# Altium schematic sheet coaster.SchDoc
size A3; SheetNumber: 1; SheetTotal: 1
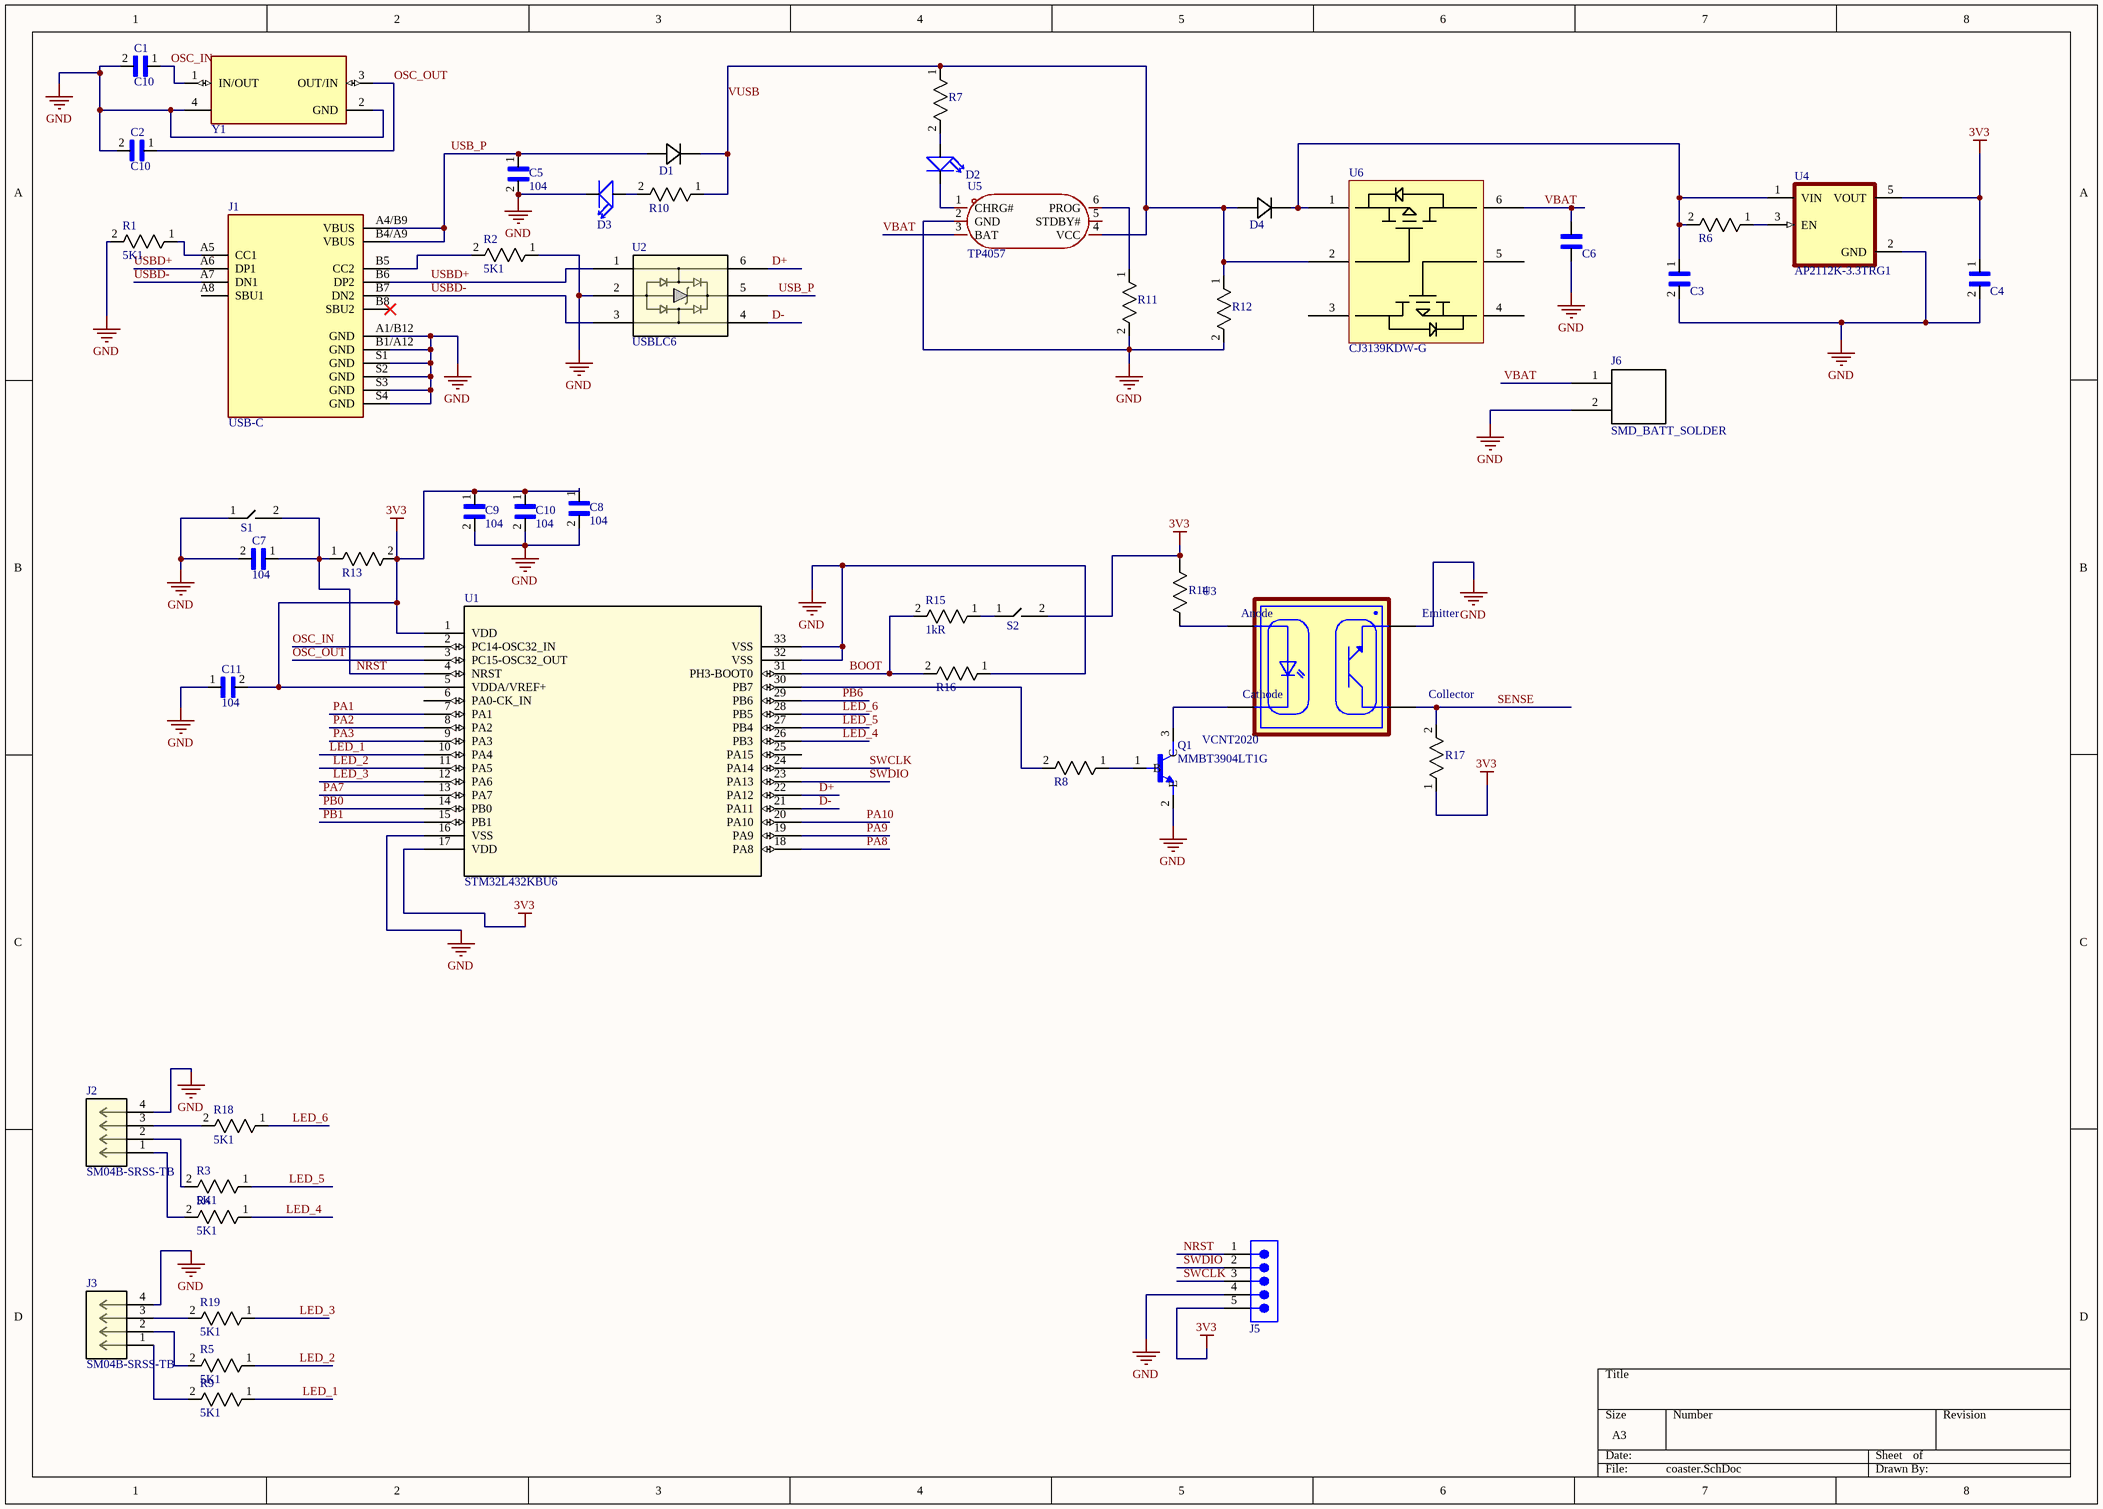
[diagram p0: coaster.SchDoc]

## Parts
C1  C10  [RC0402]
C2  C10  [RC0402]
C3  CC0402KRX5R5BB105  [RC0402]  (value not drawn)
C4  CC0402KRX5R5BB105  [RC0402]  (value not drawn)
C5  104  [CAPC1005X55N2]
C6  CL21A106KOQNNNG  [CAPC2012X140N]  (value not drawn)
C7  104  [CAPC1005X55N2]
C8  104  [CAPC1005X55N2]
C9  104  [CAPC1005X55N2]
C10  104  [CAPC1005X55N2]
C11  104  [CAPC1005X55N2]
D1  SD103AWS-E3-08  [CR_WS-E3-08_VIS-L]  (value not drawn)
D2  LED  [LEDM1608X80]  (value not drawn)
D3  LED  [LEDM1608X80]  (value not drawn)
D4  SD103AWS-E3-08  [CR_WS-E3-08_VIS-L]  (value not drawn)
J1  USB-C  [GCT_USB4110GFA]
J2  SM04B-SRSS-TB  [CONN_SM04B-SRSS-TB_JST]
J3  SM04B-SRSS-TB  [CONN_SM04B-SRSS-TB_JST]
J5  61300511121  [HEADER_M_5]  (value not drawn)
J6  SMD_BATT_SOLDER  [SMD_BATT_SOLDER]
Q1  MMBT3904LT1G  [SOT95P240X111-3N]
R1  5K1  [RC0402]
R2  5K1  [RC0402]
R3  5K1  [RC0402]
R4  5K1  [RC0402]
R5  5K1  [RC0402]
R6  15K0402  [RC0402X]  (value not drawn)
R7  ERA-2AEB332X  [RC0402]  (value not drawn)
R8  15K0402  [RC0402X]  (value not drawn)
R9  5K1  [RC0402]
R10  ERA-2AEB332X  [RC0402]  (value not drawn)
R11  RC0402JR-0710KL  [RC0402X]  (value not drawn)
R12  RC0402JR-07100KL  [RC0402X]  (value not drawn)
R13  RC0402JR-0710KL  [RC0402X]  (value not drawn)
R14  CRGCQ1206F2K2  [STA_RMCF1206_STP-L]  (value not drawn)
R15  Resistance: 1kR  [RC0402X]  (hidden comment: RC0402JR-071KL)
R16  RC0402JR-07100KL  [RC0402X]  (value not drawn)
R17  RC0402JR-0710KL  [RC0402X]  (value not drawn)
R18  5K1  [RC0402]
R19  5K1  [RC0402]
S1  SW_P  [SW]  (value not drawn)
S2  SW_P  [SW]  (value not drawn)
U1  STM32L432KBU6  [UFQFPN-32]
U2  USBLC6  [SOT23-6L_STM]
U3  VCNT2020  [XDCR_VCNT2020]
U4  AP2112K-3.3TRG1  [SOT95P285X140-5N]
U5  TP4057  [SOP65P210X110-6N]
U6  CJ3139KDW-G  [SOP65P210X110-6N]
Y1  ECS-80-12-33-JGN-TR  [XTAL_ECS-240-8-33-AGN-TR]  (value not drawn)

## Nets
3V3: C4.1 C8.1 C9.1 C10.1 C11.2 J5.5 R13.2 R14.2 R17.1 S2.2 U1.1(VDD) U1.5(VDDA/VREF+) U1.17(VDD) U4.5(VOUT)
GND: C1.2 C2.2 C3.2 C4.2 C5.2 C6.1 C7.2 C8.2 C9.2 C10.2 C11.1 D3.C J1.A1/B12(GND) J1.B1/A12(GND) J1.S1(GND) J1.S2(GND) J1.S3(GND) J1.S4(GND) J2.4 J3.4 J5.4 J6.2 Q1.2(E) R1.2 R2.1 R11.2 R12.2 R16.1 S1.1 U1.16(VSS) U1.32(VSS) U1.33(VSS) U2.2 U3.1(EMITTER) U4.2(GND) U5.2(GND) Y1.2(GND) Y1.4(GND)
BOOT: R15.2 R16.2 U1.31(PH3-BOOT0)
D+: U1.22(PA12) U2.6
D-: U1.21(PA11) U2.4
LED_1: R9.1 U1.10(PA4)
LED_2: R5.1 U1.11(PA5)
LED_3: R19.1 U1.12(PA6)
LED_4: R4.1 U1.26(PB3)
LED_5: R3.1 U1.27(PB4)
LED_6: R18.1 U1.28(PB5)
NRST: C7.1 J5.1 R13.1 S1.2 U1.4(NRST)
OSC_IN: C1.1 U1.2(PC14-OSC32_IN) Y1.1(IN/OUT)
OSC_OUT: C2.1 U1.3(PC15-OSC32_OUT) Y1.3(OUT/IN)
PA1: U1.7(PA1)
PA2: U1.8(PA2)
PA3: U1.9(PA3)
PA7: U1.13(PA7)
PA8: U1.18(PA8)
PA9: U1.19(PA9)
PA10: U1.20(PA10)
PB0: U1.14(PB0)
PB1: U1.15(PB1)
PB6: U1.29(PB6)
SENSE: R17.2 U3.2(COLLECTOR)
SWCLK: J5.3 U1.24(PA14)
SWDIO: J5.2 U1.23(PA13)
USB_P: C5.1 D1.2 J1.A4/B9(VBUS) J1.B4/A9(VBUS) U2.5
USBD+: J1.A6(DP1) J1.B6(DP2) U2.1
USBD-: J1.A7(DN1) J1.B7(DN2) U2.3
VBAT: C6.2 J6.1 U5.3(BAT) U6.6
VUSB: D1.1 D4.2 R7.1 R10.1 R12.1 U5.4(VCC) U6.2
NetC3_1: C3.1 D4.1 R6.2 U4.1(VIN) U6.1
NetD2_A: D2.A R7.2
NetD2_C: D2.C U5.1(CHRG#)
NetD3_A: D3.A R10.2
NetJ1_A5: J1.A5(CC1) R1.1
NetJ1_B5: J1.B5(CC2) R2.2
NetJ2_1: J2.1 R4.2
NetJ2_2: J2.2 R3.2
NetJ2_3: J2.3 R18.2
NetJ3_1: J3.1 R9.2
NetJ3_2: J3.2 R5.2
NetJ3_3: J3.3 R19.2
NetQ1_1: Q1.1(B) R8.1
NetQ1_3: Q1.3(C) U3.4(CATHODE)
NetR6_1: R6.1 U4.3(EN)
NetR8_2: R8.2 U1.30(PB7)
NetR11_1: R11.1 U5.6(PROG)
NetR14_1: R14.1 U3.3(ANODE)
NetR15_1: R15.1 S2.1

Not connected (* = marked no-connect by the designer): J1 A8(SBU1) B8(SBU2)*; U1 6(PA0-CK_IN) 25(PA15); U5 5(STDBY#); U6 3 4 5

## Notes on the sheet
- (in symbol VCNT2020) Anode; Emitter; Cathode; Collector

## Library data of the parts
C1 C2 = C10: 0402 10 pF 50 V ±5 % Tolerance NP0 SMT Multilayer Ceramic Capacitor; Manufacturer: Yageo; Manufacturer Part Number: CC0402JRNPO9BN100; Dielectric Material: 4241ConductorMaterial; Capacitance: 10pF; Tolerance: 5%; Voltage Rating: 50V; Dielectric: C0G; Temperature Coefficient: 30ppm/°C; Insulation Resistance: 100GR; Supplier 1: Digikey; RoHS: Yes; Category: Ceramic Capacitors; Stock 1: 1109319; Pricing 1: 1=0.1, 10=0.024, 100=0.0133, 1000=0.00812, 2500=0.00685, 5000=0.00609 (USD); Mount: Surface Mount; Case/Package: 0402; Number of Pins: 2; Case Code (Metric): 1005; Case Code (Imperial): 0402; Min Operating Temperature: -55°C; Max Operating Temperature: 125°C; Packaging: Tape and Reel; Voltage Rating (DC): 50V; Package Quantity: 1; Termination: SMD/SMT; Voltage: 50V; Series: CC; Voltage Rating (AC): 50V; Length: 1mm; Width: 0.02inch; Height: 0.5mm; Thickness: 0.022inch; Depth: 0.5mm; Radiation Hardening: No; Reach SVHC Compliant: No; Lead Free: Lead Free; RoHS Compliant: Yes; Halogen Free: 5694HalogenFree; ComponentLink1URL: https://datasheet.ciiva.com/11786/0900766b8079c870-11786158.pdf?src-supplier=Rs; ComponentLink1Description: https://datasheet.ciiva.com/11786/0900766b8079c870-11786158.pdf?src-supplier=Rs; ComponentLink2URL: https://datasheet.ciiva.com/143/mlccorderingcode-143992.pdf?src-supplier=Digikey; ComponentLink2Description: https://datasheet.ciiva.com/143/mlccorderingcode-143992.pdf?src-supplier=Digikey; ComponentLink3URL: https://datasheet.ciiva.com/143/mlccorderingcode-143993.pdf?src-supplier=Digikey; ComponentLink3Description: https://datasheet.ciiva.com/143/mlccorderingcode-143993.pdf?src-supplier=Digikey; ComponentLink4URL: https://datasheet.ciiva.com/143/mlccorderingcode-143994.pdf?src-supplier=Digikey; ComponentLink4Description: https://datasheet.ciiva.com/143/mlccorderingcode-143994.pdf?src-supplier=Digikey; ComponentLink5URL: https://datasheet.ciiva.com/8033/1443161-8033591.pdf?src-supplier=Element14; ComponentLink5Description: https://datasheet.ciiva.com/8033/1443161-8033591.pdf?src-supplier=Element14; ComponentLink6URL: https://datasheet.ciiva.com/8033/1443161-8033593.pdf?src-supplier=Element14; ComponentLink6Description: https://datasheet.ciiva.com/8033/1443161-8033593.pdf?src-supplier=Element14; ComponentLink7URL: https://datasheet.ciiva.com/8033/1443161-8033596.pdf?src-supplier=Element14; ComponentLink7Description: https://datasheet.ciiva.com/8033/1443161-8033596.pdf?src-supplier=Element14; ComponentLink8URL: https://datasheet.ciiva.com/28450/1443161-28450213.pdf?src-supplier=Element14; ComponentLink8Description: https://datasheet.ciiva.com/28450/1443161-28450213.pdf?src-supplier=Element14; ComponentLink9URL: https://datasheet.ciiva.com/5427/upy-gp-np0-16v-to-50v-8-5427741.pdf?src-supplier=Mouser; ComponentLink9Description: https://datasheet.ciiva.com/5427/upy-gp-np0-16v-to-50v-8-5427741.pdf?src-supplier=Mouser; Supplier Part Number 1: 311-1014-1-ND
C3 C4 = C105: Multilayer Ceramic Capacitor, 1 uF, 100 V, ï¿½ 10%, X7R, 0402 [1005 Metric]; Manufacturer: Yageo; Capacitance: 1uF; Voltage Rating: 6.3V; Dielectric: X5R; Temperature Coefficient: 30ppm/°C; Supplier 1: Digikey; Manufacturer Part Number: CC0402KRX5R5BB105; RoHS: Yes; Category: Ceramic Capacitors; Stock 1: 21136934; Pricing 1: 1=0.1, 10=0.054, 100=0.0318, 1000=0.02066, 2500=0.01646, 5000=0.01625 (USD); Mount: Surface Mount; Case/Package: 0402; Number of Pins: 2; Case Code (Metric): 1005; Case Code (Imperial): 0402; Dielectric Material: Ceramic; Material: Ceramic; Min Operating Temperature: -55°C; Max Operating Temperature: 85°C; Tolerance: 10%; Voltage Rating (DC): 6.3V; Packaging: Tape and Reel; Termination: SMD/SMT; Series: CC; Voltage Rating (AC): 6.3V; Length: 1mm; Width: 0.5mm; Height: 0.5mm; Depth: 0.5mm; Radiation Hardening: No; Reach SVHC Compliant: No; Lead Free: Lead Free; RoHS Compliant: Yes; Halogen Free: 5694HalogenFree; ComponentLink1URL: https://datasheet.ciiva.com/5789/70765-5789520.pdf?src-supplier=Farnell; ComponentLink1Description: https://datasheet.ciiva.com/5789/70765-5789520.pdf?src-supplier=Farnell; ComponentLink2URL: https://datasheet.ciiva.com/176/mlccorderingcode-176609.pdf?src-supplier=Digikey; ComponentLink2Description: https://datasheet.ciiva.com/176/mlccorderingcode-176609.pdf?src-supplier=Digikey; ComponentLink3URL: https://datasheet.ciiva.com/176/mlccorderingcode-176610.pdf?src-supplier=Digikey; ComponentLink3Description: https://datasheet.ciiva.com/176/mlccorderingcode-176610.pdf?src-supplier=Digikey; ComponentLink4URL: https://datasheet.ciiva.com/176/mlccorderingcode-176611.pdf?src-supplier=Digikey; ComponentLink4Description: https://datasheet.ciiva.com/176/mlccorderingcode-176611.pdf?src-supplier=Digikey; ComponentLink5URL: https://datasheet.ciiva.com/11464/upy-gphc-x5r-4v-to-50v-12-11464863.pdf?src-supplier=Avnet; ComponentLink5Description: https://datasheet.ciiva.com/11464/upy-gphc-x5r-4v-to-50v-12-11464863.pdf?src-supplier=Avnet; ComponentLink6URL: https://datasheet.ciiva.com/8033/1525783-8033643.pdf?src-supplier=Element14; ComponentLink6Description: https://datasheet.ciiva.com/8033/1525783-8033643.pdf?src-supplier=Element14; ComponentLink7URL: https://datasheet.ciiva.com/8033/1525783-8033644.pdf?src-supplier=Element14; ComponentLink7Description: https://datasheet.ciiva.com/8033/1525783-8033644.pdf?src-supplier=Element14; ComponentLink8URL: https://datasheet.ciiva.com/8033/70765-8033646.pdf?src-supplier=Element14; ComponentLink8Description: https://datasheet.ciiva.com/8033/70765-8033646.pdf?src-supplier=Element14; ComponentLink9URL: https://datasheet.ciiva.com/28450/1359354-28450285.pdf?src-supplier=Element14; ComponentLink9Description: https://datasheet.ciiva.com/28450/1359354-28450285.pdf?src-supplier=Element14; Supplier Part Number 1: 311-1438-1-ND
C5 C7-C11 = CC0402KRX7R7BB104: Multilayer Ceramic Capacitor, 0.1 uF, 16 V, ï¿½ 10%, X7R, 0402 [1005 Metric]; Manufacturer: Yageo; Material: 4241ConductorMaterial; Capacitance: 100nF; Voltage Rating: 16V; Temperature Coefficient: 30ppm/°C; Supplier 1: Digikey; Manufacturer Part Number: CC0402KRX7R7BB104; RoHS: Yes; Category: Ceramic Capacitors; Stock 1: 15609894; Pricing 1: 1=0.1, 10=0.024, 50=0.0164, 100=0.0139, 500=0.0098, 1000=0.00852, 2500=0.00718, 5000=0.00636 (USD); Mount: Surface Mount; Case/Package: 0402; Number of Pins: 2; Case Code (Metric): 1005; Case Code (Imperial): 0402; Min Operating Temperature: -55°C; Max Operating Temperature: 125°C; Tolerance: 10%; Voltage Rating (DC): 16V; Packaging: Tape and Reel; Package Quantity: 1; Dielectric: X7R; Termination: SMD/SMT; Voltage: 16V; Series: CC; Voltage Rating (AC): 16V; Length: 1mm; Width: 0.02inch; Height: 0.5mm; Thickness: 0.022inch; Depth: 0.5mm; Radiation Hardening: No; Reach SVHC Compliant: No; RoHS Compliant: Yes; Halogen Free: 5694HalogenFree; Lead Free: 5697LeadFree; ComponentLink1URL: https://datasheet.ciiva.com/11788/0900766b80ce67ed-11788364.pdf?src-supplier=Rs; ComponentLink1Description: https://datasheet.ciiva.com/11788/0900766b80ce67ed-11788364.pdf?src-supplier=Rs; ComponentLink2URL: https://datasheet.ciiva.com/7978/1489800-7978111.pdf?src-supplier=Element14; ComponentLink2Description: https://datasheet.ciiva.com/7978/1489800-7978111.pdf?src-supplier=Element14; ComponentLink3URL: https://datasheet.ciiva.com/161/mlccorderingcode-161545.pdf?src-supplier=Digikey; ComponentLink3Description: https://datasheet.ciiva.com/161/mlccorderingcode-161545.pdf?src-supplier=Digikey; ComponentLink4URL: https://datasheet.ciiva.com/161/mlccorderingcode-161544.pdf?src-supplier=Digikey; ComponentLink4Description: https://datasheet.ciiva.com/161/mlccorderingcode-161544.pdf?src-supplier=Digikey; ComponentLink5URL: https://datasheet.ciiva.com/161/mlccorderingcode-161546.pdf?src-supplier=Digikey; ComponentLink5Description: https://datasheet.ciiva.com/161/mlccorderingcode-161546.pdf?src-supplier=Digikey; ComponentLink6URL: https://datasheet.ciiva.com/8033/1734573-8033661.pdf?src-supplier=Element14; ComponentLink6Description: https://datasheet.ciiva.com/8033/1734573-8033661.pdf?src-supplier=Element14; ComponentLink7URL: https://datasheet.ciiva.com/11587/upy-gphc-x7r-6-3v-to-50v-8-11587305.pdf?src-supplier=Avnet; ComponentLink7Description: https://datasheet.ciiva.com/11587/upy-gphc-x7r-6-3v-to-50v-8-11587305.pdf?src-supplier=Avnet; LCSC: C60474; Supplier Part Number 1: 311-1338-1-ND
C6 = 10uF16v0805: 10 ÂµF Â±10% 16V Ceramic Capacitor X5R 0805 (2012 Metric); MF: Samsung Electro-Mechanics; SnapEDA_Link: https://www.snapeda.com/parts/CL21A106KOQNNNG/Samsung/view-part/?ref=snap; Package: 2012-2 SAMSUNG; Value: *; MP: CL21A106KOQNNNG; Check_prices: https://www.snapeda.com/parts/CL21A106KOQNNNG/Samsung/view-part/?ref=eda; Supplier Part Number 1: 1276-6455-2-ND
D1 D4 = SD103AWS-E3-08: SCHOTTKY DIODE SOD323; Manufacturer_Name: Vishay; Copyright: Copyright (C) 2025 Ultra Librarian. All rights reserved.; Manufacturer_Part_Number: SD103AWS-E3-08; Datasheet: https://www.vishay.com/doc?85682; Supplier Part Number 1: SD103AWS-E3-08GITR-ND
D2 D3 = LTST-C190KFKT: Single Color LED, Ultra Bright Orange, Water Clear, 1.1mm; Manufacturer: Vishay Lite-On; Lens Color: Colorless; Power Rating: 75mW; Luminous Intensity: 90mcd; Viewing Angle: 130°; Forward Current: 30mA; Forward Voltage: 2V; Lens Style: Flat,Diffused,Colorless,Rectangular,Clear; Dominant Wavelength: 605nm; Test Current: 20mA; Number of Elements: 1; Reverse Voltage: 5V; Voltage Rating: 50V; Resistance: 47kR; Tolerance: 1%; Lens Size: 0.8mm; Supplier 1: Digikey; Manufacturer Part Number: LTST-C190KFKT; RoHS: Yes; Category: LEDs; Stock 1: 96032; Pricing 1: 1=0.13, 10=0.089, 100=0.0613, 500=0.0484, 1000=0.0441, 2000=0.04042 (USD); Mount: Surface Mount; Case/Package: 0603; Number of Pins: 2; Color: Orange; Case Code (Metric): 1608; Case Code (Imperial): 0603; Min Operating Temperature: -55°C; Max Operating Temperature: 85°C; Packaging: Tape and Reel; Package Quantity: 3000; Illumination Color: Orange; Lens Transparency: Clear; Power Dissipation: 75mW; Wavelength: 605nm; Number of LEDs: 1; Series: -; Voltage Rating (DC): 50V; Length: 3.2mm; Width: 0.8mm; Height: 0.9mm; Depth: 1.6mm; Radiation Hardening: No; Lead Free: Lead Free; RoHS Compliant: Yes; Reach SVHC Compliant: 4186SVHC; ComponentLink1URL: https://datasheet.ciiva.com/11774/0900766b80dc02a7-11774744.pdf?src-supplier=Rs; ComponentLink1Description: https://datasheet.ciiva.com/11774/0900766b80dc02a7-11774744.pdf?src-supplier=Rs; ComponentLink2URL: https://datasheet.ciiva.com/15201/getdatasheetpartid-309341-15201388.pdf?src-supplier=Verical; ComponentLink2Description: https://datasheet.ciiva.com/15201/getdatasheetpartid-309341-15201388.pdf?src-supplier=Verical; ComponentLink3URL: https://datasheet.ciiva.com/16396/lite-on20ltst-c190kfkt-16396246.pdf?src-supplier=Future+Electronics; ComponentLink3Description: https://datasheet.ciiva.com/16396/lite-on20ltst-c190kfkt-16396246.pdf?src-supplier=Future+Electronics; ComponentLink4URL: https://datasheet.ciiva.com/12400/100-ltst-c190kfkt-53640-12400769.pdf?src-supplier=Mouser; ComponentLink4Description: https://datasheet.ciiva.com/12400/100-ltst-c190kfkt-53640-12400769.pdf?src-supplier=Mouser; ComponentLink5URL: https://datasheet.ciiva.com/2109/s-110-ltst-c190kfkt-2109976.pdf?src-supplier=Digikey; ComponentLink5Description: https://datasheet.ciiva.com/2109/s-110-ltst-c190kfkt-2109976.pdf?src-supplier=Digikey; ComponentLink6URL: https://datasheet.ciiva.com/2109/s-110-ltst-c190kfkt-2109977.pdf?src-supplier=Digikey; ComponentLink6Description: https://datasheet.ciiva.com/2109/s-110-ltst-c190kfkt-2109977.pdf?src-supplier=Digikey; ComponentLink7URL: https://datasheet.ciiva.com/2109/s-110-ltst-c190kfkt-2109978.pdf?src-supplier=Digikey; ComponentLink7Description: https://datasheet.ciiva.com/2109/s-110-ltst-c190kfkt-2109978.pdf?src-supplier=Digikey; Supplier Part Number 1: 160-1434-1-ND
J1 = USB4110-GF-A: C42400246; Manufacturer: HOAUC; USB Standard: 6108USBStandard; Number of Contacts: 16NUMBER; Voltage Rating: 20V; Supplier 1: Digikey; Manufacturer Part Number: C42400246; RoHS: No; Category: USB Connectors; Stock 1: 30215; Pricing 1: 1=1.64, 10=1.244, 25=1.1176, 50=1.032, 100=0.9547, 250=0.86368, 500=0.80254 (USD); Number of Pins: 16NUMBER; Contact Material: 153,157ConductorMaterial; Orientation: 5496OrientationType; Height: 3.46mm; ComponentLink1URL: https://gct.co/files/drawings/usb4110.pdf?src-supplier=Digikey; ComponentLink1Description: https://gct.co/files/drawings/usb4110.pdf?src-supplier=Digikey; Supplier Part Number 1: 2073-USB4110-GF-A-1-ND
J2 J3 = SM04B-SRSS-TB: No Description Available; Manufacturer_Name: JST; Copyright: Copyright (C) 2025 Ultra Librarian. All rights reserved.; Manufacturer_Part_Number: SM04B-SRSS-TB; RefDes: RefDes; Type: Type; Supplier Part Number 1: 455-SM04B-SRSS-TBTR-ND
J5 = HEADER_M_5: THT Vertical Pin Header WR-PHD, Pitch 2.54 mm, Single Row, 5 pins; Manufacturer: Wurth Electronics; Number of Positions: 5; Gender: Male; Contact Resistance: 20mR; Current Rating: 3A; Voltage Rating: 250V; Pitch: 0.1inch; Supplier 1: Digikey; Manufacturer Part Number: 61300511121; RoHS: Yes; Category: Headers and Wire Housings; Stock 1: 61079; Pricing 1: 1=0.24, 10=0.2, 25=0.1664, 50=0.1396, 100=0.1269, 1000=0.11625 (USD); Mount: Through Hole; Contact Plating: Gold; Contact Material: Copper; Color: Black; Min Operating Temperature: -40°C; Max Operating Temperature: 105°C; Number of Rows: 1; Packaging: Bulk; Termination: Solder; Number of Contacts: 5; Series: WR-PHD; Contact Type: Male Pin; Orientation: Vertical; Operating Supply Voltage: 250V; Height: 8.89mm; Contact Mating Length: 0.236inch; Lead Free: Lead Free; RoHS Compliant: Yes; Reach SVHC Compliant: Unknown; ComponentLink1URL: https://katalog.we-online.de/em/datasheet/6130xx11121.pdf?src-supplier=Digikey; ComponentLink1Description: https://katalog.we-online.de/em/datasheet/6130xx11121.pdf?src-supplier=Digikey; ComponentLink2URL: http://www.farnell.com/cad/1737268.pdf?src-supplier=Element14; ComponentLink2Description: http://www.farnell.com/cad/1737268.pdf?src-supplier=Element14; ComponentLink3URL: https://datasheet.octopart.com/61300511121-W%C3%BCrth-Elektronik-datasheet-21154836.pdf?src-supplier=Element14; ComponentLink3Description: https://datasheet.octopart.com/61300511121-W%C3%BCrth-Elektronik-datasheet-21154836.pdf?src-supplier=Element14; Supplier Part Number 1: 732-5318-ND
Q1 = MMBT3904LT1G: Transistor, Bipolar,Si,NPN,General Purpose,VCEO 40VDC,IC 200mA,PD 225mW,SOT-23 | ON Semiconductor MMBT3904LT1G; SnapEDA_Link: https://www.snapeda.com/parts/MMBT3904LT1G/Onsemi/view-part/?ref=snap; Package: SOT-23-3 ON Semiconductor; Value: *; MF: ON Semiconductor; MP: MMBT3904LT1G; Check_prices: https://www.snapeda.com/parts/MMBT3904LT1G/Onsemi/view-part/?ref=eda; Supplier Part Number 1: MMBT3904LT1GOSTR-ND
R1-R5 R9 R18 R19 = RC0402FR-075K1L: SMD Chip Resistor, 5.1 kOhm, ï¿½ 1%, 62.5 mW, 0402 [1005 Metric], Thick Film, General Purpose; Manufacturer: Yageo; Power Rating: 63mW; Voltage Rating: 50V; Resistance: 5.1kR; Temperature Coefficient: 100ppm/°C; Supplier 1: Digikey; Manufacturer Part Number: RC0402FR-075K1L; RoHS: Yes; Category: Chip SMD Resistors; Stock 1: 868211; Pricing 1: 1=0.1, 10=0.009, 50=0.0072, 100=0.0041, 500=0.00306 (USD); Case/Package: 0402; Case Code (Metric): 1005; Case Code (Imperial): 0402; Min Operating Temperature: -55°C; Max Operating Temperature: 155°C; Tolerance: 1%; Packaging: Tape and Reel; Package Quantity: 1; Resistor Type: Thick Film; Number of Terminations: 2; Termination: SMD/SMT; Max Power Dissipation: 63mW; Features: Moisture Resistant; Series: RC; Resistance Tolerance: 1%; Technology: THICK FILM; Voltage Rating (DC): 50V; Working Voltage: 50V; Construction: Rectangular; Length: 1mm; Width: 0.02inch; Height: 0.016inch; Depth: 0.5mm; RoHS Compliant: Yes; Reach SVHC Compliant: Unknown; Lead Free: 5697LeadFree; Military Standard: Not; Supplier Part Number 1: 311-5.10KLRCT-ND; LCSC: C105872
R6 R8 = 15K0402: Res Thin Film 0402 15K Ohm 0.1% 0.063W(1/16W) ±25ppm/C Pad SMD T/R; Manufacturer: Yageo; Manufacturer Part Number: RT0402BRD0715KL; Voltage Rating: 50V; Resistance: 15kR; Power Rating: 62.5mW; Max Power Dissipation: 63mW; Temperature Coefficient: 25ppm/°C; Supplier 1: Digikey; RoHS: Yes; Category: Chip SMD Resistors; Stock 1: 36293; Pricing 1: 1=0.17, 10=0.116, 50=0.1, 100=0.0877, 500=0.06834, 1000=0.06018, 5000=0.04488 (USD); Case/Package: 0402; Case Code (Imperial): 0402; Case Code (Metric): 1005; Size Code: 0402; Min Operating Temperature: -55°C; Max Operating Temperature: 155°C; Tolerance: 0.1%; Number of Terminations: 2; Termination: SMD/SMT; Voltage Rating (DC): 50V; Features: Moisture Resistant; Packaging: Tape and Reel; Package Quantity: 10000; Series: RT; Length: 0.039inch; Width: 0.02inch; Height: 0.014inch; Lead Free: Lead Free; RoHS Compliant: Yes; ComponentLink1URL: https://datasheet.ciiva.com/2582/pyu-rt-1-to-0-05-rohs-l-5-2582151.pdf?src-supplier=Digikey; ComponentLink1Description: https://datasheet.ciiva.com/2582/pyu-rt-1-to-0-05-rohs-l-5-2582151.pdf?src-supplier=Digikey; ComponentLink2URL: https://datasheet.ciiva.com/12723/pyu-rt-1-to-0-05-rohs-l-4-12723782.pdf?src-supplier=Mouser; ComponentLink2Description: https://datasheet.ciiva.com/12723/pyu-rt-1-to-0-05-rohs-l-4-12723782.pdf?src-supplier=Mouser; Supplier Part Number 1: YAG2302CT-ND
R7 R10 = 3.3K402: Res Thin Film 0402 3.3K Ohm 0.1% 0.063W ±25ppm/°C Molded SMD Punched Carrier T/R; Manufacturer: Panasonic; Resistance: 3.3kR; Power Rating: 63mW; Voltage Rating: 25V; Supplier 1: Digikey; Manufacturer Part Number: ERA-2AEB332X; RoHS: Yes; Category: Chip SMD Resistors; Stock 1: 52848; Pricing 1: 1=0.1, 10=0.082, 50=0.0716, 100=0.0677, 500=0.05944, 1000=0.05637, 5000=0.05076 (USD); Mount: Surface Mount; Case/Package: 0402; Number of Pins: 2; Case Code (Metric): 1005; Case Code (Imperial): 0402; Contact Plating: Tin; Weight: 2.8E-05oz; Size Code: 0402; Min Operating Temperature: -55°C; Max Operating Temperature: 155°C; Tolerance: 0.1%; Packaging: Tape and Reel; Package Quantity: 1; Termination: SMD/SMT; Resistor Type: Thin Film,Metal Film; Number of Terminations: 2; Temperature Coefficient: 25ppm/°C; Max Power Dissipation: 63mW; Voltage Rating (DC): 25V; Series: ERA; Resistance Tolerance: 0.1%; Technology: METAL FILM; Length: 1mm; Width: 0.5mm; Height: 0.35mm; Depth: 0.5mm; Radiation Hardening: No; Reach SVHC Compliant: No; Lead Free: Lead Free; RoHS Compliant: Yes; ComponentLink1URL: https://datasheet.ciiva.com/30239/54aoa0000ce26-30239514.pdf?src-supplier=Onlinecomponents.com; ComponentLink1Description: https://datasheet.ciiva.com/30239/54aoa0000ce26-30239514.pdf?src-supplier=Onlinecomponents.com; ComponentLink2URL: https://datasheet.ciiva.com/16395/aoa0000ce26-16395246.pdf?src-supplier=Future+Electronics; ComponentLink2Description: https://datasheet.ciiva.com/16395/aoa0000ce26-16395246.pdf?src-supplier=Future+Electronics; Supplier Part Number 1: P3.3KDCCT-ND
R11 R13 R17 = 10K0402: SMD Chip Resistor, 10 Kohm, ½ 5%, 62.5 Mw, 0402 [1005 Metric], Thick Film, General Purpose; Manufacturer: Yageo; Power Rating: 62.5mW; Voltage Rating: 50V; Max Power Dissipation: 63mW; Resistance: 10kR; Temperature Coefficient: 100ppm/°C; Supplier 1: Digikey; Manufacturer Part Number: RC0402JR-0710KL; RoHS: Yes; Category: Chip SMD Resistors; Stock 1: 12014577; Pricing 1: 1=0.1, 10=0.007, 50=0.0066, 100=0.0061, 500=0.0051, 1000=0.00408, 5000=0.00306 (USD); Case/Package: 0402; Case Code (Imperial): 0402; Case Code (Metric): 1005; Size Code: 0402; Min Operating Temperature: -55°C; Max Operating Temperature: 155°C; Packaging: Tape and Reel; Tolerance: 5%; Termination: SMD/SMT; Features: Moisture Resistant; Number of Terminations: 2; Voltage Rating (AC): 50V; Package Quantity: 1; Resistor Type: Thick Film; Series: RC; Resistance Tolerance: 5%; Construction: Rectangular; Length: 0.039inch; Width: 0.02inch; Height: 0.016inch; Depth: 0.5mm; Lead Free: Lead Free; Reach SVHC Compliant: Unknown; Military Standard: Not; RoHS Compliant: Yes; ComponentLink1URL: https://datasheet.ciiva.com/2452/pyu-r-int-thick-7-2452626.pdf?src-supplier=Digikey; ComponentLink1Description: https://datasheet.ciiva.com/2452/pyu-r-int-thick-7-2452626.pdf?src-supplier=Digikey; ComponentLink2URL: https://datasheet.ciiva.com/2452/pyu-r-int-thick-7-2452627.pdf?src-supplier=Digikey; ComponentLink2Description: https://datasheet.ciiva.com/2452/pyu-r-int-thick-7-2452627.pdf?src-supplier=Digikey; ComponentLink3URL: https://datasheet.ciiva.com/2452/pyu-r-int-thick-7-2452628.pdf?src-supplier=Digikey; ComponentLink3Description: https://datasheet.ciiva.com/2452/pyu-r-int-thick-7-2452628.pdf?src-supplier=Digikey; ComponentLink4URL: https://datasheet.ciiva.com/7850/1018594-7850136.pdf?src-supplier=Element14; ComponentLink4Description: https://datasheet.ciiva.com/7850/1018594-7850136.pdf?src-supplier=Element14; ComponentLink5URL: https://datasheet.ciiva.com/7850/1018594-7850137.pdf?src-supplier=Element14; ComponentLink5Description: https://datasheet.ciiva.com/7850/1018594-7850137.pdf?src-supplier=Element14; ComponentLink6URL: https://datasheet.ciiva.com/12669/pyu-rc0402-51-rohs-l-6-r-12669687.pdf?src-supplier=Mouser; ComponentLink6Description: https://datasheet.ciiva.com/12669/pyu-rc0402-51-rohs-l-6-r-12669687.pdf?src-supplier=Mouser; Supplier Part Number 1: 311-10KJRCT-ND
R12 R16 = 100K0402: SMD Chip Resistor, 100 Kohm, ½ 5%, 62.5 Mw, 0402 [1005 Metric], Thick Film, General Purpose; Manufacturer: Yageo; Resistance: 100kR; Power Rating: 62.5mW; Voltage Rating: 50V; Temperature Coefficient: 100ppm/°C; Max Power Dissipation: 63mW; Supplier 1: Digikey; Manufacturer Part Number: RC0402JR-07100KL; RoHS: Yes; Category: Chip SMD Resistors; Stock 1: 5152961; Pricing 1: 1=0.1, 10=0.006, 50=0.0056, 100=0.0051, 500=0.00306, 1000=0.00284 (USD); Case/Package: 0402; Case Code (Imperial): 0402; Case Code (Metric): 1005; Size Code: 0402; Min Operating Temperature: -55°C; Max Operating Temperature: 155°C; Tolerance: 5%; Packaging: Tape and Reel; Number of Terminations: 2; Termination: SMD/SMT; Features: Moisture Resistant; Resistor Type: Thick Film; Series: RC; Resistance Tolerance: 5%; Construction: Rectangular; Voltage Rating (AC): 50V; Length: 1mm; Depth: 0.5mm; Military Standard: Not; Lead Free: Lead Free; Reach SVHC Compliant: Unknown; RoHS Compliant: Yes; ComponentLink1URL: https://datasheet.ciiva.com/2491/pyu-r-int-thick-7-2491208.pdf?src-supplier=Digikey; ComponentLink1Description: https://datasheet.ciiva.com/2491/pyu-r-int-thick-7-2491208.pdf?src-supplier=Digikey; ComponentLink2URL: https://datasheet.ciiva.com/2491/pyu-r-int-thick-7-2491209.pdf?src-supplier=Digikey; ComponentLink2Description: https://datasheet.ciiva.com/2491/pyu-r-int-thick-7-2491209.pdf?src-supplier=Digikey; ComponentLink3URL: https://datasheet.ciiva.com/2491/pyu-r-int-thick-7-2491207.pdf?src-supplier=Digikey; ComponentLink3Description: https://datasheet.ciiva.com/2491/pyu-r-int-thick-7-2491207.pdf?src-supplier=Digikey; ComponentLink4URL: https://datasheet.ciiva.com/17052/pyu-rc0402-51-rohs-l-6-r-17052137.pdf?src-supplier=Future+Electronics; ComponentLink4Description: https://datasheet.ciiva.com/17052/pyu-rc0402-51-rohs-l-6-r-17052137.pdf?src-supplier=Future+Electronics; ComponentLink5URL: https://datasheet.ciiva.com/46394/1018594-46394941.pdf?src-supplier=Element14; ComponentLink5Description: https://datasheet.ciiva.com/46394/1018594-46394941.pdf?src-supplier=Element14; ComponentLink6URL: https://datasheet.ciiva.com/7850/1018594-7850133.pdf?src-supplier=Element14; ComponentLink6Description: https://datasheet.ciiva.com/7850/1018594-7850133.pdf?src-supplier=Element14; ComponentLink7URL: https://datasheet.ciiva.com/12668/pyu-rc0402-51-rohs-l-6-r-12668218.pdf?src-supplier=Mouser; ComponentLink7Description: https://datasheet.ciiva.com/12668/pyu-rc0402-51-rohs-l-6-r-12668218.pdf?src-supplier=Mouser; Supplier Part Number 1: 311-100KJRCT-ND
R14 = R1206F2K2: SMD Chip Resistor, 2.2 kOhm, ± 1%, 250 mW, 1206 [3216 Metric], Thick Film, General Purpose; Manufacturer: TE Connectivity; Power Rating: 250mW; Resistance: 2.2kR; Temperature Coefficient: 100ppm/°C; Voltage Rating: 200V; Supplier 1: Digikey; Manufacturer Part Number: CRGCQ1206F2K2; RoHS: Yes; Category: Chip SMD Resistors; Stock 1: 205224; Pricing 1: 1=0.1, 10=0.046, 100=0.0242, 1000=0.01451, 2500=0.01234 (USD); Case/Package: 1206; Min Operating Temperature: -55°C; Max Operating Temperature: 155°C; Packaging: Cut Tape; Voltage Rating (DC): 200V; Operating Supply Voltage: 200V; Height: 650um; RoHS Compliant: Yes; ComponentLink1URL: https://www.te.com/commerce/DocumentDelivery/DDEController?Action=srchrtrv&DocNm=1773204-3&DocType=DS&DocLang=English&src-supplier=Digikey; ComponentLink1Description: https://www.te.com/commerce/DocumentDelivery/DDEController?Action=srchrtrv&DocNm=1773204-3&DocType=DS&DocLang=English&src-supplier=Digikey; ComponentLink2URL: https://www.te.com/commerce/DocumentDelivery/DDEController?Action=srchrtrv&amp;DocNm=1773204-3&amp;DocType=DS&amp;DocLang=English&src-supplier=Digikey; ComponentLink2Description: https://www.te.com/commerce/DocumentDelivery/DDEController?Action=srchrtrv&amp;DocNm=1773204-3&amp;DocType=DS&amp;DocLang=English&src-supplier=Digikey; ComponentLink3URL: https://datasheet.octopart.com/CRGCQ1206F2K2-TE-Connectivity-datasheet-114679081.pdf?src-supplier=Master+Electronics; ComponentLink3Description: https://datasheet.octopart.com/CRGCQ1206F2K2-TE-Connectivity-datasheet-114679081.pdf?src-supplier=Master+Electronics; Supplier Part Number 1: A129814CT-ND
R15 = 1K0402: SMD Chip Resistor, 1 Kohm, ½ 5%, 63 Mw, 0402 [1005 Metric], Thick Film, General Purpose; Manufacturer: Yageo; Power Rating: 62.5mW; Voltage Rating: 50V; Max Power Dissipation: 63mW; Temperature Coefficient: 100ppm/°C; Supplier 1: Digikey; Manufacturer Part Number: RC0402JR-071KL; RoHS: Yes; Category: Chip SMD Resistors; Stock 1: 7795419; Pricing 1: 1=0.1, 10=0.007, 50=0.0056, 100=0.0041, 500=0.00356, 1000=0.00306, 5000=0.00284 (USD); Case/Package: 0402; Case Code (Imperial): 0402; Case Code (Metric): 1005; Size Code: 0402; Min Operating Temperature: -55°C; Max Operating Temperature: 155°C; Tolerance: 5%; Packaging: Cut Tape; Termination: SMD/SMT; Features: Moisture Resistant; Number of Terminations: 2; Voltage Rating (AC): 50V; Package Quantity: 1; Resistor Type: Thick Film; Series: RC; Resistance Tolerance: 5%; Length: 0.039inch; Width: 0.02inch; Height: 0.016inch; Reach SVHC Compliant: No; Lead Free: Lead Free; RoHS Compliant: Yes; ComponentLink1URL: https://datasheet.ciiva.com/2452/pyu-r-int-thick-7-2452755.pdf?src-supplier=Digikey; ComponentLink1Description: https://datasheet.ciiva.com/2452/pyu-r-int-thick-7-2452755.pdf?src-supplier=Digikey; ComponentLink2URL: https://datasheet.ciiva.com/2452/pyu-r-int-thick-7-2452756.pdf?src-supplier=Digikey; ComponentLink2Description: https://datasheet.ciiva.com/2452/pyu-r-int-thick-7-2452756.pdf?src-supplier=Digikey; ComponentLink3URL: https://datasheet.ciiva.com/2452/pyu-r-int-thick-7-2452757.pdf?src-supplier=Digikey; ComponentLink3Description: https://datasheet.ciiva.com/2452/pyu-r-int-thick-7-2452757.pdf?src-supplier=Digikey; Supplier Part Number 1: 311-1.0KJRCT-ND
S1 S2 = SW_P: Switch Tactile N.O. SPST Round Button Gull Wing 0.05A 12VDC 0.98N SMD T/R; Manufacturer: Alps Electric; Manufacturer Part Number: SKRKAHE020; Supplier 1: Digikey; RoHS: Yes; Category: Tactile Switches; Stock 1: 19659; Pricing 1: 1=0.41, 10=0.351, 25=0.3276, 100=0.2931, 250=0.27156, 500=0.2563, 1000=0.24208 (USD); RoHS Compliant: Yes; ComponentLink1URL: http://datasheet.octopart.com/SKRKAHE020-ALPS-datasheet-41327033.pdf?src-supplier=Farnell; ComponentLink1Description: http://datasheet.octopart.com/SKRKAHE020-ALPS-datasheet-41327033.pdf?src-supplier=Farnell; ComponentLink2URL: http://datasheet.octopart.com/SKRKAHE020-ALPS-datasheet-41327033.pdf?src-supplier=Avnet; ComponentLink2Description: http://datasheet.octopart.com/SKRKAHE020-ALPS-datasheet-41327033.pdf?src-supplier=Avnet; ComponentLink3URL: http://datasheet.octopart.com/SKRKAHE020-ALPS-datasheet-41327033.pdf?src-supplier=Onlinecomponents.com; ComponentLink3Description: http://datasheet.octopart.com/SKRKAHE020-ALPS-datasheet-41327033.pdf?src-supplier=Onlinecomponents.com; ComponentLink4URL: http://datasheet.octopart.com/SKRKAHE020-ALPS-datasheet-41327033.pdf?src-supplier=Verical; ComponentLink4Description: http://datasheet.octopart.com/SKRKAHE020-ALPS-datasheet-41327033.pdf?src-supplier=Verical; ComponentLink5URL: http://datasheet.octopart.com/SKRKAHE020-ALPS-datasheet-41327033.pdf?src-supplier=Future+Electronics; ComponentLink5Description: http://datasheet.octopart.com/SKRKAHE020-ALPS-datasheet-41327033.pdf?src-supplier=Future+Electronics; ComponentLink6URL: https://datasheet.octopart.com/SKRKAHE020-ALPS-datasheet-156009340.pdf?src-supplier=Electro+Sonic; ComponentLink6Description: https://datasheet.octopart.com/SKRKAHE020-ALPS-datasheet-156009340.pdf?src-supplier=Electro+Sonic; ComponentLink7URL: http://datasheet.octopart.com/SKRKAHE020-ALPS-datasheet-41327033.pdf?src-supplier=Quest; ComponentLink7Description: http://datasheet.octopart.com/SKRKAHE020-ALPS-datasheet-41327033.pdf?src-supplier=Quest; ComponentLink8URL: https://datasheet.octopart.com/SKRKAHE020-ALPS-datasheet-41327033.pdf?src-supplier=Master+Electronics; ComponentLink8Description: https://datasheet.octopart.com/SKRKAHE020-ALPS-datasheet-41327033.pdf?src-supplier=Master+Electronics; Supplier Part Number 1: 4809-SKRKAHE020CT-ND
U1 = STM32L432KBU6: Ultra-low-power with FPU ARM Cortex-M4 MCU 80 MHz with 128 Kbytes Flash, USB; Manufacturer: STMicroelectronics; Interface: I2C,SPI,USB,IrDA,UART,USART; Peripherals: Brown-out Detect/Reset,PWM,WDT,DMA; Number of I/Os: 26; Memory Size: 128KB; Oscillator Type: Internal; Supplier 1: Digikey; Manufacturer Part Number: STM32L432KBU6; RoHS: Yes; Category: Microcontrollers; Stock 1: 10176; Pricing 1: 1=4.33, 10=3.284, 25=3.0224, 100=2.7343, 250=2.59696, 500=2.51416, 1000=2.44602, 2940=2.3632 (USD); Case/Package: UFQFPN; Min Operating Temperature: -40°C; Max Operating Temperature: 85°C; Memory Type: FLASH; Packaging: Tray; Core Architecture: ARM; Series: STM32L4; RoHS Compliant: Yes; ComponentLink1URL: http://www.farnell.com/datasheets/2283391.pdf?src-supplier=Farnell; ComponentLink1Description: http://www.farnell.com/datasheets/2283391.pdf?src-supplier=Farnell; ComponentLink2URL: http://www.st.com/content/ccc/resource/technical/document/datasheet/24/01/9f/59/f0/83/47/fc/DM00257205.pdf/files/DM00257205.pdf/jcr:content/translations/en.DM00257205.pdf?src-supplier=Digikey; ComponentLink2Description: http://www.st.com/content/ccc/resource/technical/document/datasheet/24/01/9f/59/f0/83/47/fc/DM00257205.pdf/files/DM00257205.pdf/jcr:content/translations/en.DM00257205.pdf?src-supplier=Digikey; ComponentLink3URL: http://www.farnell.com/datasheets/2283391.pdf?src-supplier=Newark; ComponentLink3Description: http://www.farnell.com/datasheets/2283391.pdf?src-supplier=Newark; ComponentLink4URL: https://datasheet.octopart.com/STM32L432KBU6-STMicroelectronics-datasheet-62336852.pdf?src-supplier=SHENGYU+ELECTRONICS; ComponentLink4Description: https://datasheet.octopart.com/STM32L432KBU6-STMicroelectronics-datasheet-62336852.pdf?src-supplier=SHENGYU+ELECTRONICS; ComponentLink5URL: https://datasheet.octopart.com/STM32L432KBU6-STMicroelectronics-datasheet-137130199.pdf?src-supplier=TME; ComponentLink5Description: https://datasheet.octopart.com/STM32L432KBU6-STMicroelectronics-datasheet-137130199.pdf?src-supplier=TME; Supplier Part Number 1: 497-16577-ND
U2 = USBLC6-2SC6: ESD Suppressor Diode Array Dual Uni-Dir 15kV Air Gap/15kV Contact Disc 6-Pin SOT-23 T/R; Manufacturer: STMicroelectronics; Data Rate: 480Mbps; Direction: Unidirectional,Bidirectional; Capacitance: 3.5pF; Operating Supply Voltage: 1.1V; Number of Elements: 1; Number of Channels: 2; Reverse Breakdown Voltage: 6V; Clamping Voltage: 17V; Working Voltage: 5V; Reverse Standoff Voltage: 5.25V; Power Line Protection: Yes; Test Current: 1mA; Max Reverse Leakage Current: 150nA; Peak Pulse Current: 5A; Supplier 1: Digikey; Manufacturer Part Number: USBLC6-2SC6; RoHS: Yes; Category: TVS Diodes; Stock 1: 85420; Pricing 1: 1=0.36, 10=0.243, 100=0.163, 500=0.127, 1000=0.114, 3000=0.09, 6000=0.084, 9000=0.078, 15000=0.077, 21000=0.0755, 30000=0.075 (USD); Mount: Surface Mount; Case/Package: SOT-23; Number of Pins: 6; Min Operating Temperature: -40°C; Max Operating Temperature: 125°C; Packaging: Tape and Reel; Package Quantity: 3000; Polarity: Unidirectional,Bidirectional; Breakdown Voltage: 6V; Termination: SMD/SMT; Number of Bidirectional Channels: 2; Min Breakdown Voltage: 6V; ESD Protection: Yes; Max Breakdown Voltage: 6V; Leakage Current: 150nA; Series: USB; Clamping Voltage-Max: 17V; Max Repetitive Reverse Voltage (Vrrm): 5.25V; Length: 3.05mm; Width: 1.75mm; Height: 1.3mm; Depth: 1.75mm; Radiation Hardening: No; Reach SVHC Compliant: No; Lead Free: Lead Free; RoHS Compliant: Yes; ComponentLink1URL: https://datasheet.ciiva.com/1268/1690354-1268384.pdf?src-supplier=Element14; ComponentLink1Description: https://datasheet.ciiva.com/1268/1690354-1268384.pdf?src-supplier=Element14; ComponentLink2URL: https://datasheet.ciiva.com/4508/cd00050750-113117-4508433.pdf?src-supplier=Mouser; ComponentLink2Description: https://datasheet.ciiva.com/4508/cd00050750-113117-4508433.pdf?src-supplier=Mouser; ComponentLink3URL: https://datasheet.ciiva.com/41444/001184109-da-01-en-ic-esd-protecti-usblc6-2sc6-sot-23-6-stm-41444156.pdf?src-supplier=Conrad; ComponentLink3Description: https://datasheet.ciiva.com/41444/001184109-da-01-en-ic-esd-protecti-usblc6-2sc6-sot-23-6-stm-41444156.pdf?src-supplier=Conrad; Supplier Part Number 1: 497-5235-1-ND; LCSC: C5250994
U3 = VCNT2020: Reflective Optical Sensor 0.02 (0.5mm) 4-SMD Module; MF: Vishay; SnapEDA_Link: https://www.snapeda.com/parts/VCNT2020/Vishay+Semiconductor+Opto+Division/view-part/?ref=snap; Package: SMD-4 Vishay; Value: *; MP: VCNT2020; Check_prices: https://www.snapeda.com/parts/VCNT2020/Vishay+Semiconductor+Opto+Division/view-part/?ref=eda; Supplier Part Number 1: VCNT2020TR-ND
U4 = AP2112K-3.3TRG1: Linear Voltage Regulator IC Positive Fixed 1 Output 600mA SOT-25; MF: Diodes Inc.; Value: *; Purchase-URL: https://pricing.snapeda.com/search/part/AP2112K-3.3TRG1/?ref=eda; Package: SOT-753 Diodes Inc.; Availability: In Stock; Check_prices: https://www.snapeda.com/parts/AP2112K-3.3TRG1/Diodes+Inc./view-part/?ref=eda; Price: None; SnapEDA_Link: https://www.snapeda.com/parts/AP2112K-3.3TRG1/Diodes+Inc./view-part/?ref=snap; MP: AP2112K-3.3TRG1; Supplier Part Number 1: AP2112K-3.3TRG1DITR-ND
U5 = TP4057: 6.5V /Polymer 1 500mA SOT-23-6 Battery Management ICs ROHS; Manufacturer: UMW(Youtai Semiconductor); Supplier 1: Digikey; Manufacturer Part Number: TP4057; RoHS: No; Category: Battery Management; Stock 1: 6000; Pricing 1: 1=0.24, 10=0.162, 25=0.1436, 100=0.1227, 250=0.1128, 500=0.10682, 1000=0.10191 (USD); Supplier Part Number 1: 4518-TP4057CT-ND
U6 = CJ3139KDW-G: Trans Mosfet P-ch 20V 0.66A 6-PIN SOT-363 T/r; Manufacturer: Comchip; Continuous Drain Current (ID): 660mA; Rds On Max: 520mR; Input Capacitance: 170pF; Max Power Dissipation: 150mW; Supplier 1: Digikey; Manufacturer Part Number: CJ3139KDW-G; RoHS: Yes; Stock 1: 972; Pricing 1: 1=0.54, 10=0.412, 100=0.2644, 500=0.2005, 1000=0.17988 (USD); Mount: Surface Mount; Case/Package: SOT-363; Min Operating Temperature: -40°C; Max Operating Temperature: 150°C; Packaging: Cut Tape; Drain to Source Voltage (Vdss): 20V; Series: -; RoHS Compliant: Yes; ComponentLink1URL: http://www.comchiptech.com/admin/files/product/CJ3139KDW-G RevA829375.pdf?src-supplier=Digikey; ComponentLink1Description: http://www.comchiptech.com/admin/files/product/CJ3139KDW-G RevA829375.pdf?src-supplier=Digikey; Supplier Part Number 1: 641-1793-1-ND
Y1 = Crystal_8MHz_SMD: Crystal 8MHz ±20ppm (Tol) ±30ppm (Stability) 12pF FUND 400Ohm 4-Pin Mini-CSMD T/R; Manufacturer: ECS International; Supplier 1: Digikey; Manufacturer Part Number: ECS-80-12-33-JGN-TR; RoHS: No; Category: Crystals; Stock 1: 25392; Pricing 1: 1=0.56, 10=0.486, 50=0.4402, 100=0.422, 500=0.38258 (USD); RoHS Compliant: Yes; ComponentLink1URL: https://datasheet.octopart.com/ECS-80-12-33-JGN-TR-ECS-International-datasheet-140089731.pdf?src-supplier=Future+Electronics; ComponentLink1Description: https://datasheet.octopart.com/ECS-80-12-33-JGN-TR-ECS-International-datasheet-140089731.pdf?src-supplier=Future+Electronics; ComponentLink2URL: https://datasheet.octopart.com/ECS-80-12-33-JGN-TR-ECS-International-datasheet-17018741.pdf?src-supplier=Master+Electronics; ComponentLink2Description: https://datasheet.octopart.com/ECS-80-12-33-JGN-TR-ECS-International-datasheet-17018741.pdf?src-supplier=Master+Electronics; Supplier Part Number 1: 50-ECS-80-12-33-JGN-CT-ND